# EAGLE design LinkSprite_Camera_Schematic2 (EAGLE 9.5.1)
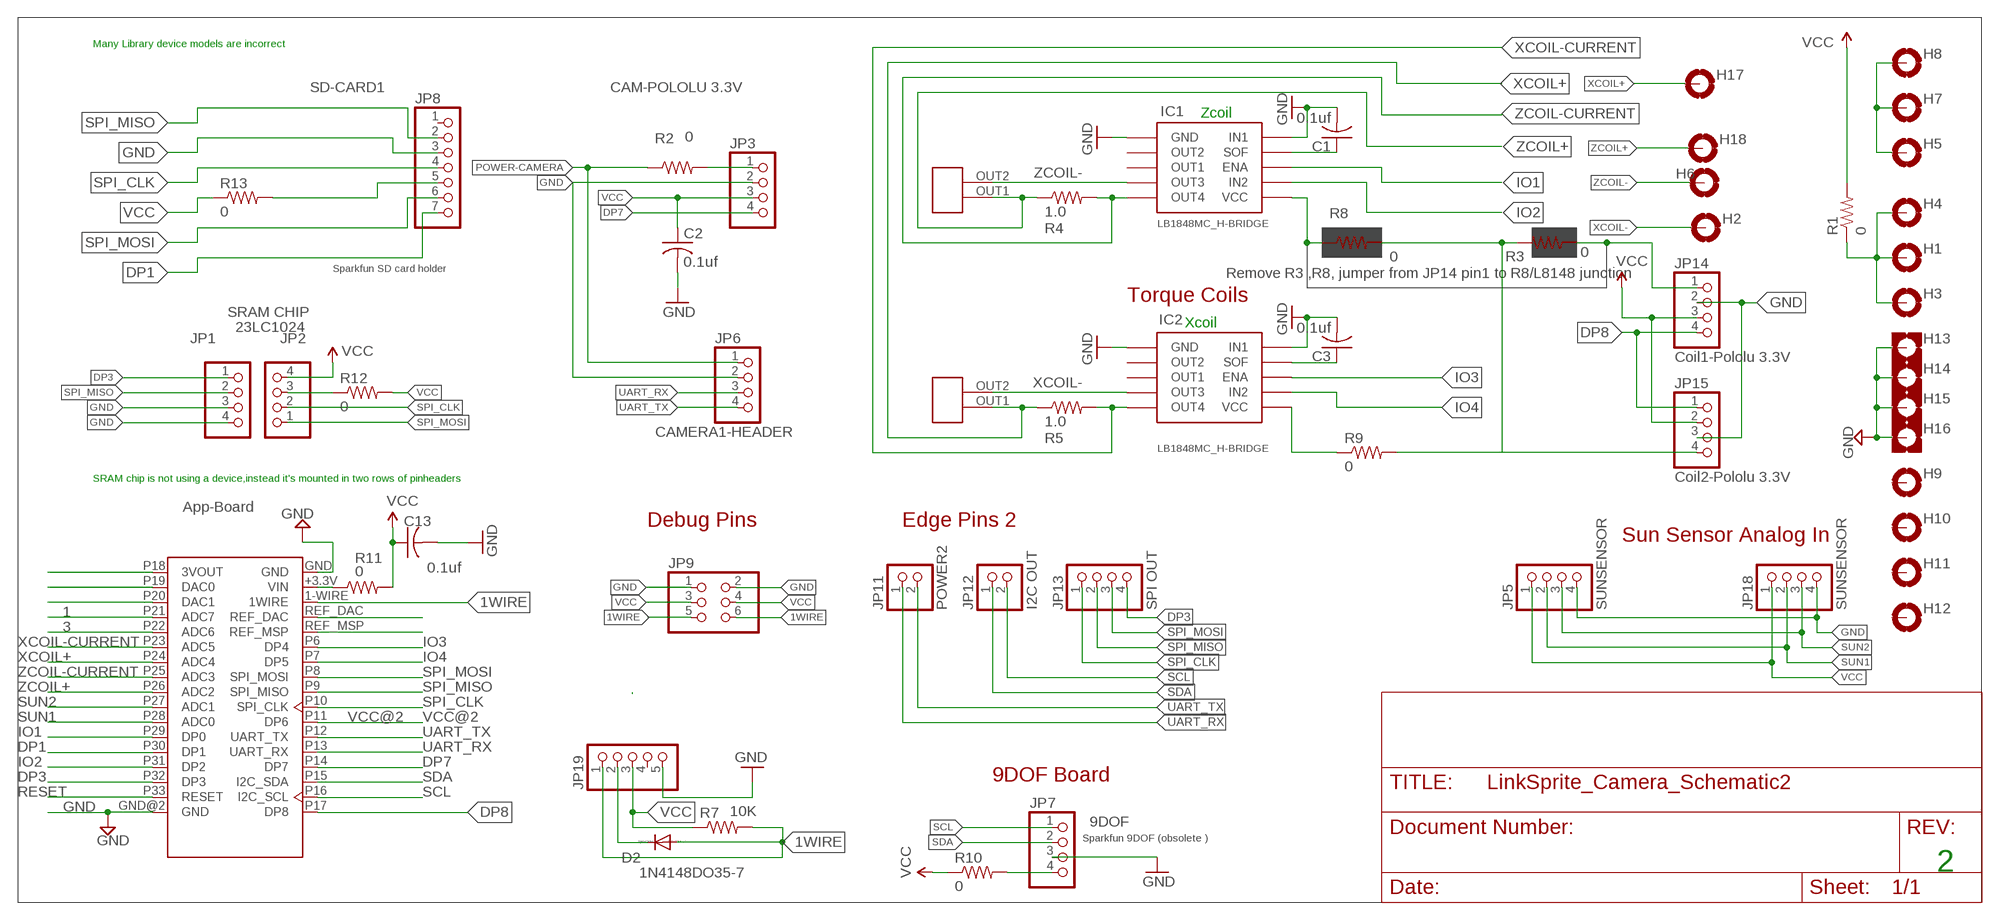
[diagram p0: schematic, sheet 1]

## Parts
C1  0.1uf  C-USC1206  [C1206]
C2  0.1uf  C-USC0805  [C0805]
C3  0.1uf  C-USC1206  [C1206]
C13  0.1uf  C-USC0805  [C0805]
D2  1N4148DO35-7  [DO35-7]
H1  MOUNT-PAD-ROUND3.3  [3,3-PAD]
H2  MOUNT-PAD-ROUND3.3  [3,3-PAD]
H3  MOUNT-PAD-ROUND3.3  [3,3-PAD]
H4  MOUNT-PAD-ROUND3.3  [3,3-PAD]
H5  MOUNT-PAD-ROUND3.3  [3,3-PAD]
H6  MOUNT-PAD-ROUND3.3  [3,3-PAD]
H7  MOUNT-PAD-ROUND3.3  [3,3-PAD]
H8  MOUNT-PAD-ROUND3.3  [3,3-PAD]
H9  MOUNT-PAD-ROUND3.3  [3,3-PAD]
H10  MOUNT-PAD-ROUND3.3  [3,3-PAD]
H11  MOUNT-PAD-ROUND3.3  [3,3-PAD]
H12  MOUNT-PAD-ROUND3.3  [3,3-PAD]
H13  MOUNT-PAD-SQUARE3.3  [3,3-PAD-SQUARE]
H14  MOUNT-PAD-SQUARE3.3  [3,3-PAD-SQUARE]
H15  MOUNT-PAD-SQUARE3.3  [3,3-PAD-SQUARE]
H16  MOUNT-PAD-SQUARE3.3  [3,3-PAD-SQUARE]
H17  MOUNT-PAD-ROUND3.3  [3,3-PAD]
H18  MOUNT-PAD-ROUND3.3  [3,3-PAD]
IC1  LB1848MC_H-BRIDGE  [LB1848MC_H-BRIDGE]
IC2  LB1848MC_H-BRIDGE  [LB1848MC_H-BRIDGE]
JP1  SRAMLEFT  PINHD-1X4  [1X04]
JP2  23LC1024  PINHD-1X4  [1X04]
JP3  CAM-POLOLU 3.3V  PINHD-1X4  [1X04]
JP5  SUNSENSOR  PINHD-1X4  [1X04]
JP6  CAMERA1-HEADER  PINHD-1X4  [1X04]
JP7  9DOF  PINHD-1X4  [1X04]
JP8  SD-CARD1  PINHD-1X7  [1X07]
JP9  PINHD-2X3  [2X03]
JP11  POWER2  PINHD-1X2  [1X02]
JP12  I2C OUT  PINHD-1X2  [1X02]
JP13  SPI OUT  PINHD-1X4  [1X04]
JP14  Coil1-Pololu 3.3V  PINHD-1X4  [1X04]
JP15  Coil2-Pololu 3.3V  PINHD-1X4  [1X04]
JP18  SUNSENSOR  PINHD-1X4  [1X04]
JP19  PINHD-1X5  [1X05]
R1  0  R-US_R0805  [R0805]
R2  0  R-US_R0805  [R0805]
R3  0  R-US_R0805  [R0805]
R4  1.0  R-US_R1206  [R1206]
R5  1.0  R-US_R1206  [R1206]
R7  10K  R-US_0204/7  [0204/7]
R8  0  R-US_R0805  [R0805]
R9  0  R-US_R0805  [R0805]
R10  0  R-US_R0805  [R0805]
R11  0  R-US_R0805  [R0805]
R12  0  R-US_R0805  [R0805]
R13  0  R-US_R0805  [R0805]
U$1  App-Board 1.2/1.3  APP_CORE  [APPCORE_RECEIVER]
U$5  COIL_PINOUT  [COIL_PINOUT]
U$6  COIL_PINOUT  [COIL_PINOUT]

## Nets
1: U$1.P21(ADC7)
1WIRE: D2.A H5.B3,3(MOUNT) H7.B3,3(MOUNT) H8.B3,3(MOUNT) JP9.5 JP9.6 JP19.1 R7.2 U$1.1-WIRE(1WIRE)
3: U$1.P22(ADC6)
COIL-POWER: JP15.4 R3.2 R8.2 R9.2
DP1: JP8.7 U$1.P30(DP1)
DP3: JP1.1 JP13.4 U$1.P32(DP3)
DP7: JP3.4 U$1.P14(DP7)
DP8: JP14.4 JP15.1 U$1.P17(DP8)
GND: C1.2 C2.2 C3.2 C13.2 H13.B3,3(MOUNT) H14.B3,3(MOUNT) H15.B3,3(MOUNT) H16.B3,3(MOUNT) IC1.GND IC1.IN1 IC2.GND IC2.IN1 JP1.3 JP1.4 JP3.2 JP5.4 JP6.2 JP7.3 JP8.3 JP9.1 JP9.2 JP14.2 JP15.3 JP18.4 JP19.5 U$1.GND U$1.GND@2(GND)
IO1: IC1.ENA U$1.P29(DP0)
IO2: IC1.IN2 U$1.P31(DP2)
IO3: IC2.ENA U$1.P6(DP4)
IO4: IC2.IN2 U$1.P7(DP5)
N$1: JP14.1 R3.1
N$2: H1.B3,3(MOUNT) H3.B3,3(MOUNT) H4.B3,3(MOUNT) R1.1
N$6: JP3.1 R2.2
N$7: IC1.VCC R8.1
N$9: IC2.VCC R9.1
N$10: JP7.4 R10.2
N$11: D2.C JP19.2
N$12: R11.1 U$1.+3.3V(VIN)
N$13: C3.1 IC2.SOF
N$14: C1.1 IC1.SOF
N$15: JP2.3 R12.1
N$16: JP8.5 R13.2
N$22: U$1.REF_DAC
N$23: U$1.REF_MSP
N$34: U$1.P18(3VOUT)
N$35: U$1.P19(DAC0)
N$36: U$1.P20(DAC1)
POWER-CAMERA: JP6.1 R2.1
RESET: U$1.P33(RESET)
SCL: JP7.1 JP12.2 U$1.P16(I2C_SCL)
SDA: JP7.2 JP12.1 U$1.P15(I2C_SDA)
SPI_CLK: JP2.2 JP8.4 JP13.1 U$1.P10(SPI_CLK)
SPI_MISO: JP1.2 JP8.2 JP13.2 U$1.P9(SPI_MISO)
SPI_MOSI: JP2.1 JP8.6 JP13.3 U$1.P8(SPI_MOSI)
SUN1: JP5.2 JP18.2 U$1.P28(ADC0)
SUN2: JP5.3 JP18.3 U$1.P27(ADC1)
UART_RX: JP6.3 JP11.1 U$1.P13(UART_RX)
UART_TX: JP6.4 JP11.2 U$1.P12(UART_TX)
VCC: C2.1 C13.1 JP2.4 JP3.3 JP5.1 JP9.3 JP9.4 JP14.3 JP15.2 JP18.1 JP19.3 R1.2 R7.1 R10.1 R11.2 R12.2 R13.1
VCC@2: U$1.P11(DP6)
XCOIL+: H17.B3,3(MOUNT) R5.1 U$1.P24(ADC4) U$6.OUT1
XCOIL-: H2.B3,3(MOUNT) IC2.OUT3 U$6.OUT2
XCOIL-CURRENT: IC2.OUT4 R5.2 U$1.P23(ADC5)
ZCOIL+: H18.B3,3(MOUNT) R4.1 U$1.P26(ADC2) U$5.OUT1
ZCOIL-: H6.B3,3(MOUNT) IC1.OUT3 U$5.OUT2
ZCOIL-CURRENT: IC1.OUT4 R4.2 U$1.P25(ADC3)
Unconnected: H9.B3,3(MOUNT) H10.B3,3(MOUNT) H11.B3,3(MOUNT) H12.B3,3(MOUNT) IC1.OUT1 IC1.OUT2 IC2.OUT1 IC2.OUT2 JP8.1 JP19.4

## Notes on the sheet
- Many Library device models are incorrect
- Zcoil
- IC1
- LB1848MC_H-BRIDGE
- Sparkfun SD card holder
- Remove R3 ,R8, jumper from JP14 pin1 to R8/L8148 junction
- Torque Coils
- SRAM CHIP | Xcoil
- IC2
- LB1848MC_H-BRIDGE
- SRAM chip is not using a device,instead it's mounted in two rows of pinheaders
- App-Board
- Debug Pins | Edge Pins 2
- Sun Sensor Analog In
- 9DOF Board
- Sparkfun 9DOF (obsolete )
- 2

## Library data of the parts
C1 C3 = rcl:C-US: CAPACITOR, American symbol
C2 C13 = resistor:C-US: CAPACITOR, American symbol
D2 = diode:1N4148: DIODE high speed (Philips)
H1-H12 H17 H18 = holes:MOUNT-PAD-ROUND: MOUNTING PAD, round
H13-H16 = holes:MOUNT-PAD-SQUARE: MOUNTING PAD, square
IC1 IC2 = 9DoF_board:LB1848MC_H-BRIDGE; DIGI_KEY: LB1848MC-AHOSCT-ND
JP1 JP3 JP5 JP7 JP13-JP15 JP18 = pinhead:PINHD-1X4: PIN HEADER
JP2 = pinhead:PINHD-1X4: PIN HEADER; DIGI-KEY: 23LC1024-I/P-ND
JP6 = pinhead:PINHD-1X4: PIN HEADER; DIGIKEY: SAM10018-ND
JP8 = pinhead:PINHD-1X7: PIN HEADER
JP9 = pinhead:PINHD-2X3: PIN HEADER
JP11 JP12 = pinhead:PINHD-1X2: PIN HEADER
JP19 = pinhead:PINHD-1X5: PIN HEADER
R1 R3 R7 = rcl:R-US_: RESISTOR, American symbol
R2 = rcl:R-US_: RESISTOR, American symbol; DIGI-KEY: 311-0.0ARCT-ND
R4 R5 R8-R13 = resistor:R-US_: RESISTOR, American symbol
U$1 = LearningByMaking2:APP_CORE
U$5 U$6 = 9DoF_board:COIL_PINOUT

## Module CAMERA
Ports: 

### Library data of the parts

## Board
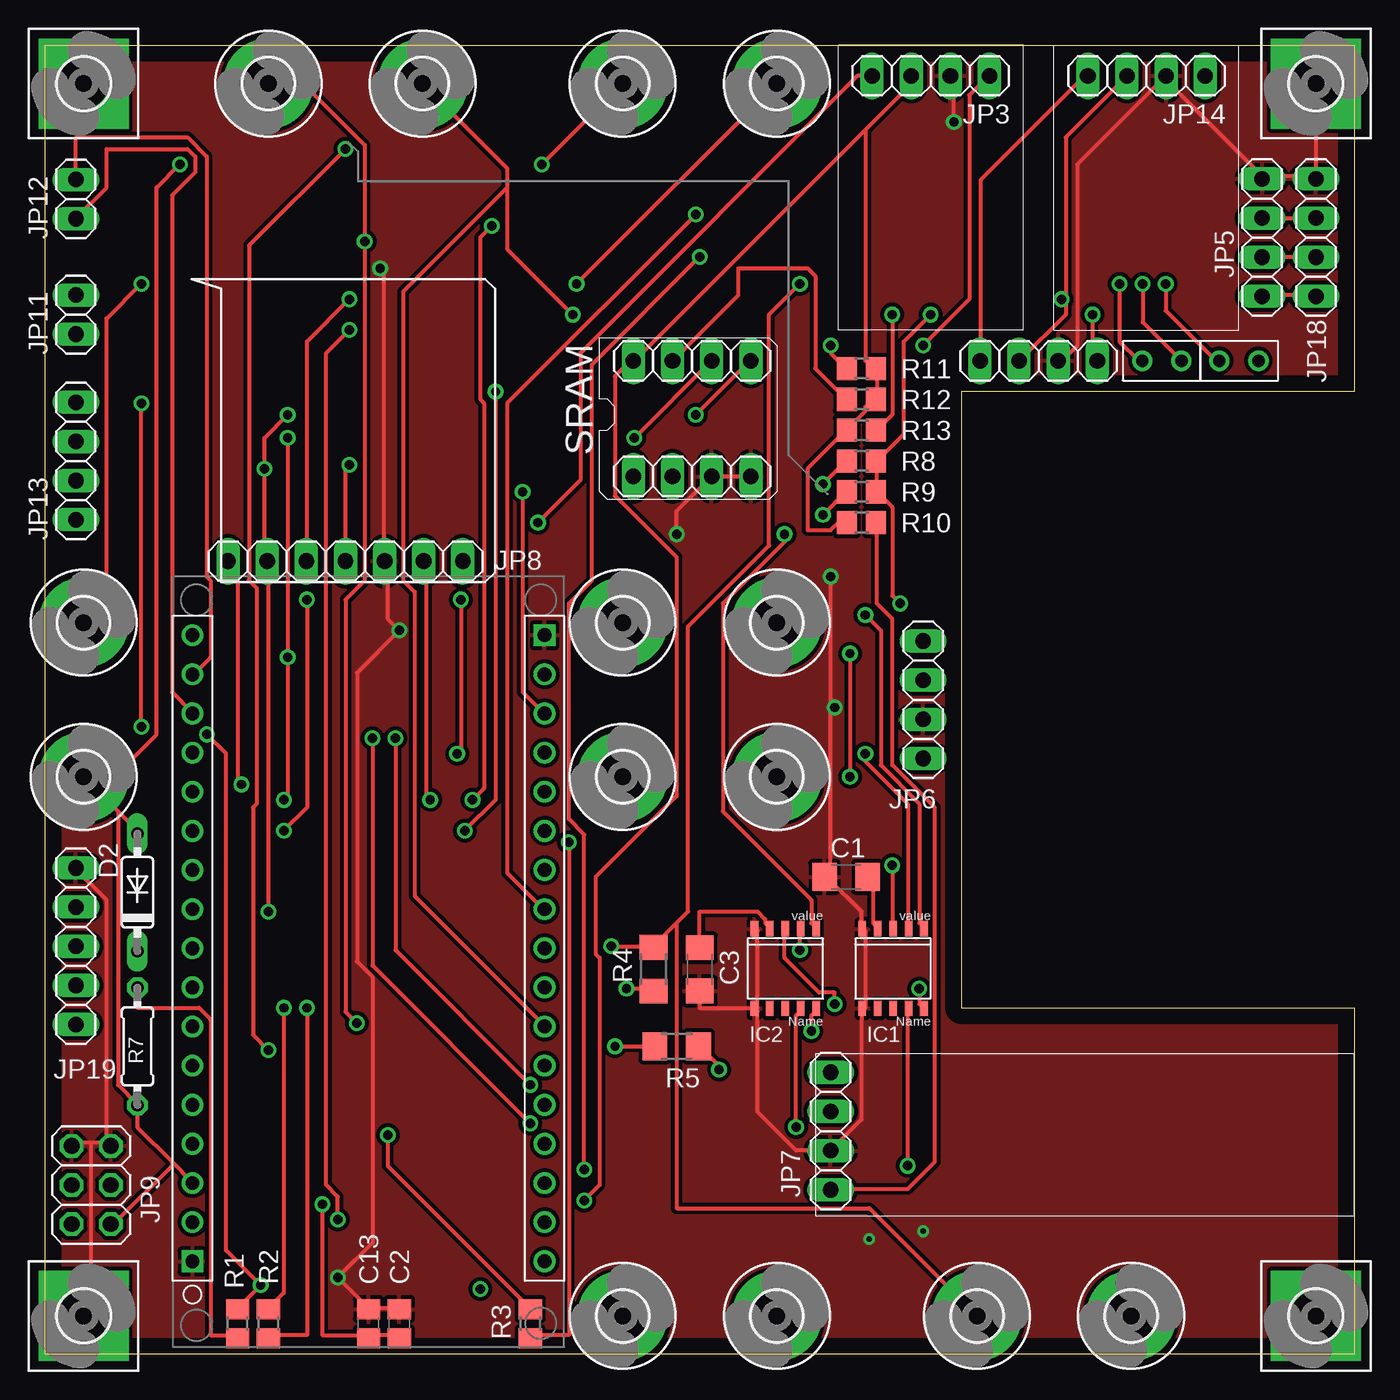
[diagram p1: board, top side]
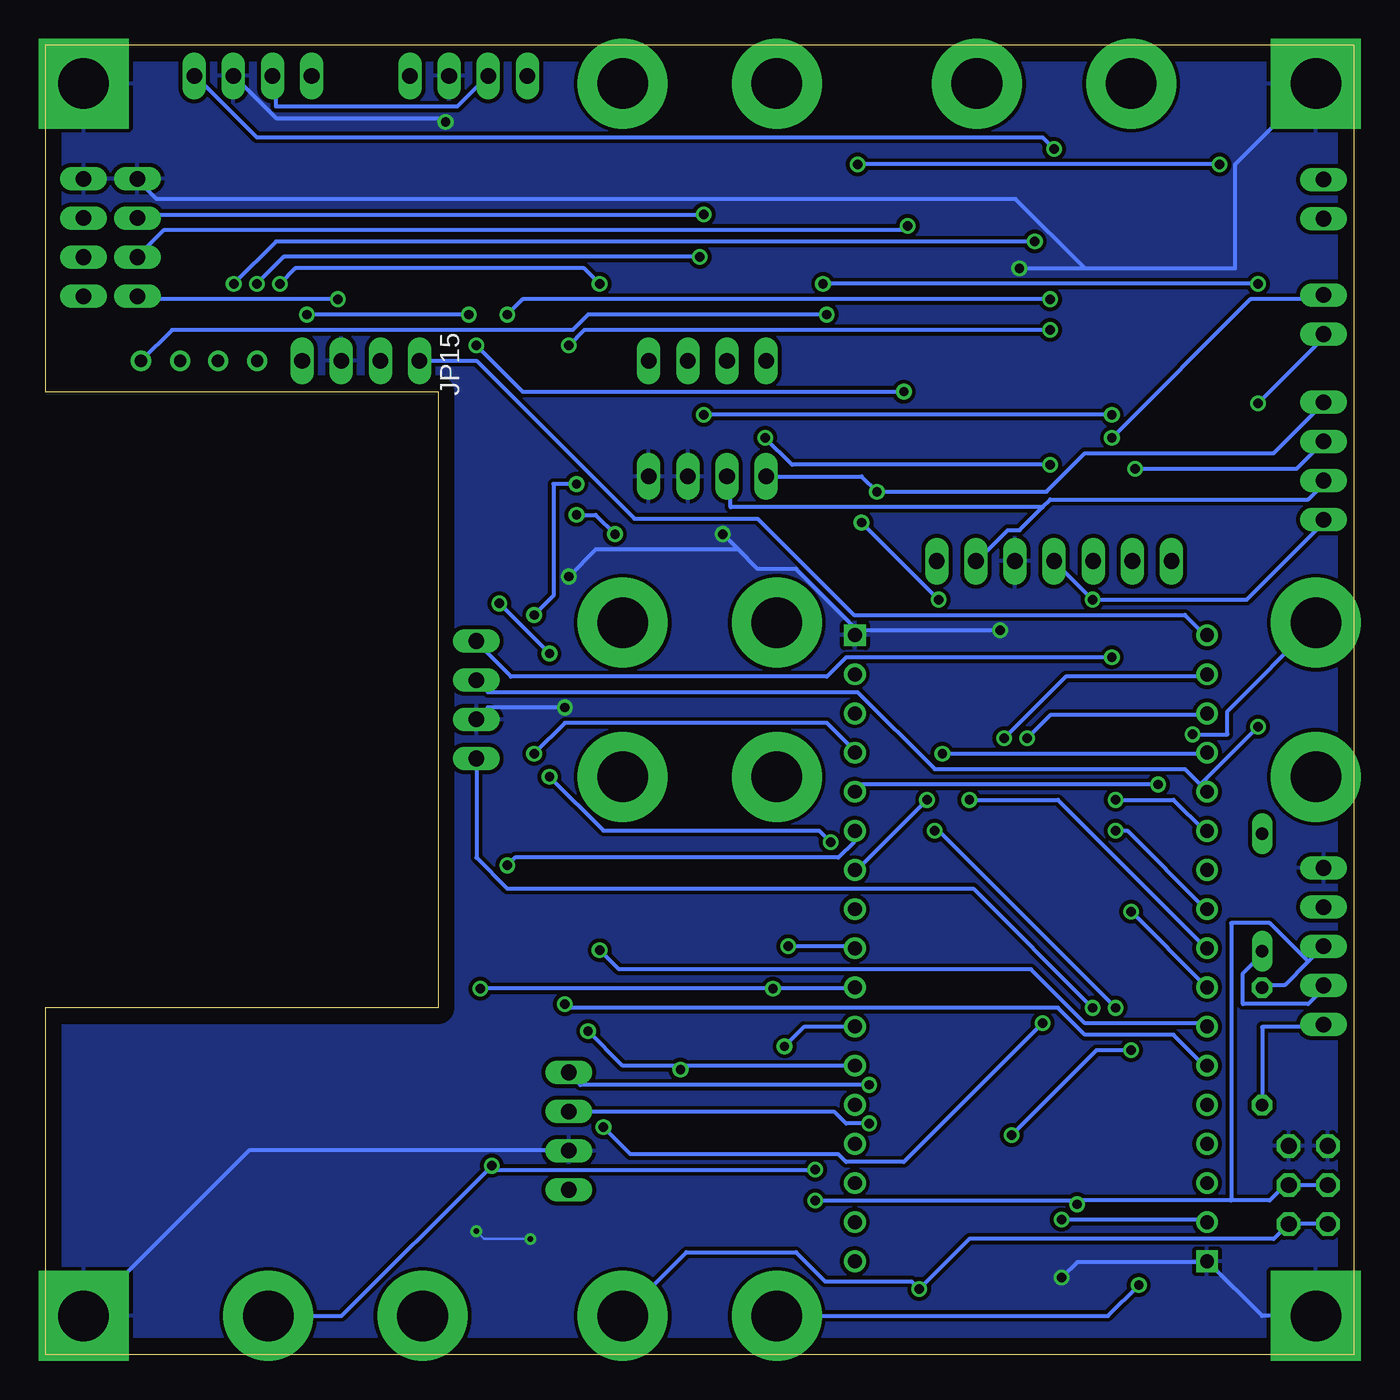
[diagram p2: board, bottom side, seen from below]

Size 85 x 85 mm. Coordinates in mm from the lower left corner, seen from the top.
Outline: 0,0 0,85 85,85 85,62.5 59.5,62.5 59.5,22.5 85,22.5 85,0 0,0
Copper layers (1*16): Top 0.035mm / dielectric 1.5mm / Bottom 0.035mm
Design rules "default *": minimum track width 10mil, minimum drill 24mil, track to track 10mil, track to pad 10mil, pad to pad 10mil, via to via 10mil, smd to smd 8mil, copper to edge 40mil, drill to drill 8mil, minimum pad ring 10mil, minimum via ring 8mil, stop-mask expansion 4mil, vias tented up to drill 0mil, thermal gap 10mil

### Footprints (pad centres in the part's own frame; a part is rotated, then mirrored left to right if it is on the bottom)
C1206 = smd 1.6 x 1.8: 1 -1.4,0; 2 1.4,0
C0805 = smd 1.3 x 1.5: 1 -0.95,0; 2 0.95,0
DO35-7 = drill 0.813 long: A 3.81,0; C -3.81,0
3,3-PAD = drill 3.3 pad 5.842: B3,3 0,0
3,3-PAD-SQUARE = drill 3.3 pad 5.842 square: B3,3 0,0
LB1848MC_H-BRIDGE = smd 0.492 x 1.002: ENA 2.45,-0.632; GND 4.45,4.533; IN1 4.45,-0.632; IN2 1.45,-0.632; OUT1 2.45,4.533; OUT2 3.45,4.533; OUT3 1.45,4.533; OUT4 0.45,4.533; SOF 3.45,-0.632; VCC 0.45,-0.632
1X04 = drill 1.016 long: 1 -3.81,0; 2 -1.27,0; 3 1.27,0; 4 3.81,0
1X07 = drill 1.016 long: 1 -7.62,0; 2 -5.08,0; 3 -2.54,0; 4 0,0; 5 2.54,0; 6 5.08,0; 7 7.62,0
2X03 = drill 1.016 octagon: 1 -2.54,-1.27; 2 -2.54,1.27; 3 0,-1.27; 4 0,1.27; 5 2.54,-1.27; 6 2.54,1.27
1X02 = drill 1.016 long: 1 -1.27,0; 2 1.27,0
1X05 = drill 1.016 long: 1 -5.08,0; 2 -2.54,0; 3 0,0; 4 2.54,0; 5 5.08,0
R0805 = smd 1.3 x 1.5: 1 -0.95,0; 2 0.95,0
R1206 = smd 1.6 x 1.803: 1 -1.422,0; 2 1.422,0
0204/7 = drill 0.813 octagon: 1 -3.81,0; 2 3.81,0
APPCORE_RECEIVER = drill 0.9: 1-WIRE 11.43,14.37; +3.3V 11.43,16.91; P6 11.43,6.75; P7 11.43,4.21; P8 11.43,1.67; P9 11.43,-0.87; P10 11.43,-3.41; P11 11.43,-5.95; P12 11.43,-8.49; P13 11.43,-11.03; P14 11.43,-13.57; P15 11.43,-16.11; P16 11.43,-18.65; P17 11.43,-21.19; P18 -11.43,19.45; P19 -11.43,16.91; P20 -11.43,14.37; P21 -11.43,11.83; P22 -11.43,9.29; P23 -11.43,6.75; P24 -11.43,4.21; P25 -11.43,1.67; P26 -11.43,-0.87; P27 -11.43,-3.41; P28 -11.43,-5.95; P29 -11.43,-8.49; P30 -11.43,-11.03; P31 -11.43,-13.57; P32 -11.43,-16.11; P33 -11.43,-18.65; REF_DAC 11.43,11.83; REF_MSP 11.43,9.29 | drill 0.9 square: GND 11.43,19.45; GND@2 -11.43,-21.19
COIL_PINOUT = drill 0.8: OUT1 0,1.27; OUT2 0,-1.27

### Placement (x,y rotation side)
C1  52,31 180 top
C2  23,2 90 top
C3  42.5,25 270 top
C13  21,2 90 top
D2  6,30 90 top
H1  37.5,2.5 0 top
H2  14.5,82.5 0 top
H3  47.5,82.5 0 top
H4  2.5,47.5 0 top
H5  47.5,2.5 0 top
H6  70.5,2.5 0 top
H7  2.5,37.5 0 top
H8  37.5,82.5 0 top
H9  47.5,47.5 0 top
H10  47.5,37.5 0 top
H11  37.5,47.5 0 top
H12  37.5,37.5 0 top
H13  82.5,82.5 0 top
H14  2.5,82.5 0 top
H15  82.5,2.5 0 top
H16  2.5,2.5 0 top
H17  24.5,82.5 0 top
H18  60.5,2.5 0 top
IC1  57.5,27 180 top
IC2  50.5,27 180 top
JP1  42,57 0 top
JP2  42,64.5 180 top
JP3  57.5,83 180 top
JP5  79,72.5 90 top
JP6  57,42.5 90 top
JP7  51,14.5 270 top
JP8  19.5,51.5 180 top
JP9  3,11 270 top
JP11  2,67.5 90 top
JP12  2,75 90 top
JP13  2,58 90 top
JP14  71.5,83 180 top
JP15  64.5,64.5 0 top
JP18  82.5,72.5 90 top
JP19  2,26.5 90 top
R1  12.5,2 270 top
R2  14.5,2 90 top
R3  31.5,2 270 top
R4  39.5,25 270 top
R5  41,20 0 top
R7  6,20 270 top
R8  53,58 0 top
R9  53,56 0 top
R10  53,54 0 top
R11  53,64 0 top
R12  53,62 0 top
R13  53,60 0 top
U$1  21,25.5 180 top
U$5  72.5,64.5 90 top
U$6  77.5,64.5 270 top

### Tracks (layer width: path | path; a pad name or v marks a point on that pad's centre or on a via)
1WIRE  (via drill 0.61)
  Top 0.254: 8.25,12.5 6,14.75 R7.2 6,16.25 4.75,17.5 4.75,35.25 | 8.25,12.5 9.5,11.25 U$1.1-WIRE | 8.25,12.5 8.25,12.25 4.5,8.5 JP9.6 | 3.5,36.5 4.75,35.25 | 4.75,35.25 6,34 D2.A | v32.25,77.25 H8.B3,3 | v8.75,77.25 7.25,75.75 7.25,40.25 3.5,36.5 | 3.5,36.5 H7.B3,3
  Bottom 0.254: H5.B3,3 43.37,6.63 36.25,6.63 34.37,4.75 28.75,4.75 v28.25,4.25 25,7.5 5.25,7.5 4.5,8.25 JP9.6 4.25,8.5 1.75,8.5 JP9.5 | R7.2 6,21.25 2,21.25 JP19.1 | v8.75,77.25 v32.25,77.25
COIL-POWER  (via drill 0.61)
  Top 0.254: v34,33.25 34,1.25 31.5,1.25 R3.2 | v52.25,45.5 v52.25,37.5 | v55.5,48.75 55,49.25 55,55 54,56 | 54,56 54,58 | 54,56 R9.2 | v68,67.5 68,64.75 68.25,64.5 JP15.4 | v57.5,67.5 55.75,65.75 55.75,59.75 54,58 | 54,58 R8.2
  Bottom 0.254: v34,33.25 34.75,34 48.75,34 v52.25,37.5 | v55.5,48.75 v52.25,45.5 | v57.5,67.5 v68,67.5
DP1  (via drill 0.61)
  Top 0.254: v12.75,37 12.5,37.25 12.5,51 12,51.5 JP8.7
  Bottom 0.254: v12.75,37 32,37 32.25,36.75 U$1.P30
DP3  (via drill 0.61)
  Top 0.254: v31,56 31,43 32.25,41.75 U$1.P32
  Bottom 0.254: JP1.1 32,57 v31,56 20,56 17.5,58.5 5.25,58.5 2,61.75 JP13.4
DP7  (via drill 0.61)
  Top 0.254: v26.75,39 27,39.25 v27,49 | v32,54 34.75,56.75 34.75,65 52.75,83 JP3.4
  Bottom 0.254: v26.75,39 9.75,39 U$1.P14 | v32,54 v27,49
DP8
  Top 0.254: JP14.4 67.5,83 60.75,76.25 60.75,64.5 JP15.1
  Bottom 0.254: JP15.1 57,64.5 46.75,54.25 38.75,54.25 32.5,48 11,48 9.75,46.75 U$1.P17
GND  (via drill 0.35, 0.61)
  Top 0.254: C3.2 42.5,22.5 46,22.5 IC2.GND | IC2.IN1 46.25,27.5 46.25,22.5 IC2.GND | 51,30.75 53,28.75 53,27.75 IC1.IN1 53.25,27.5 53.25,22.5 IC1.GND 53,22.25 53,15.25 51,13.25 | 51,30.75 50.75,31 C1.2 51,30.75 | 51,30.75 51,41.75 v51.25,42 51,42.25 v51,50.5 | 51,13.25 48.75,13.25 46.25,15.75 46.25,22.25 IC2.GND | 51,13.25 JP7.3 | 4,13.75 4.25,13.75 JP9.2 4,13.75 | 4,13.75 3,13.75 | 3,13.75 1.75,13.75 JP9.1 | 4,13.75 4,29.5 2,31.5 JP19.5 | 21,3 23,3 C2.2 | 21,3 v19,5 21.25,7.25 21.25,24.5 20.25,25.5 20.25,44.25 v23,47 22.25,47.75 22.25,51.5 JP8.3 22,51.5 22,70.25 v21.75,70.5 | 21,3 C13.2 | 3,13.75 3,3 H16.B3,3 | 82.5,76.5 79,76.5 | H13.B3,3 82.5,76.5 | 82.5,76.5 JP18.4 | JP15.3 66,64.5 67,65.5 67,77.25 72.75,83 JP14.2 73,83 73,82.5 79,76.5 | v59,80 59,83 JP3.2 | 79,76.5 JP5.4 | JP1.4 JP1.3 43.25,57 41,54.75 v41,53.25
  Bottom 0.152: v53.5,7.5 56.5,7.5 v57,8
  Bottom 0.254: v51.25,42 56.25,42 57,41.25 JP6.2 | H15.B3,3 71.75,13.25 51,13.25 JP7.3 | v19,5 18,6 9.75,6 U$1.GND 9.5,6 6,2.5 H16.B3,3 | v59,80 59.25,80.25 70,80.25 72.75,83 JP14.2 | 32,47 32.25,46.75 U$1.GND@2 32,47 | v23,47 32,47 | 40,52.25 38.75,51 36.25,51 32.25,47 32,47 | 40,52.25 v41,53.25 | H14.B3,3 7.75,77.25 7.75,70.5 17.5,70.5 | v21.75,70.5 17.5,70.5 | 17.5,70.5 22,75 77.75,75 79,76.25 JP5.4 | v51,50.5 49.25,52.25 40,52.25
  pour Top: 0,85 85,85 85,62.5 59.5,62.5 59.5,22.5 85,22.5 85,0 0,0
  pour Bottom: 0,85 85,85 85,62.5 59.5,62.5 59.5,22.5 85,22.5 85,0 0,0
IO1  (via drill 0.61)
  Top 0.254: v55,31.75 55,27.75 IC1.ENA
  Bottom 0.254: v55,31.75 54.5,32.25 33.5,32.25 32.5,33.25 32.5,33.75 U$1.P29
IO2  (via drill 0.61)
  Top 0.254: v53.25,39 53.25,38.5 56,35.75 56,27.75 IC1.IN2
  Bottom 0.254: v53.25,39 51.25,41 34.25,41 32.5,39.25 U$1.P31
IO3  (via drill 0.61)
  Top 0.254: v51.25,22.75 51.25,23.5 50.25,23.5 48,25.75 48,27.5 IC2.ENA
  Bottom 0.254: v51.25,22.75 51,22.5 19.25,22.5 17.5,20.75 11.75,20.75 9.75,18.75 U$1.P6
IO4  (via drill 0.61)
  Top 0.254: v49,26.25 49,27.5 IC2.IN2
  Bottom 0.254: v49,26.25 47.75,25 21,25 17.5,21.5 9.75,21.5 U$1.P7
N$1  (via drill 0.61)
  Top 0.254: v22.25,14.25 22.25,12.25 31.5,3 R3.1 | v14.5,19.75 13.5,20.75 13.5,35.5 13.75,35.75 13.75,49.75 13.25,50.25 13.25,72 v19.5,78.25
  Bottom 0.254: v22.25,14.25 16.75,19.75 v14.5,19.75 | v19.5,78.25 20.25,79 71.25,79 75.25,83 JP14.1
N$2  (via drill 0.61)
  Top 0.254: R1.1 12.5,3 v14,4.5 11.75,6.75 11.75,39 v10.5,40.25 | v34.5,69.5 H3.B3,3 | v6.25,69.5 4,67.25 4,49 H4.B3,3
  Bottom 0.254: v14,4.5 16,2.5 H1.B3,3 | H4.B3,3 8.25,41.75 8.25,40.25 v10.5,40.25 | v6.25,69.5 v34.5,69.5
N$6  (via drill 0.61)
  Top 0.254: v15.5,22.5 15.5,4 14.5,3 R2.2 | v27.25,34 29.25,36 v29.25,62.5 | v57,65.5 60,68.5 60,81.75 61.25,83 JP3.1
  Bottom 0.254: v15.5,22.5 27,34 v27.25,34 | v29.25,62.5 54,62.5 v57,65.5
N$7  (via drill 0.61)
  Top 0.254: v53.25,48 54.25,47 54.25,38.25 56.75,35.75 56.75,28 57,27.75 IC1.VCC | v50.5,56.5 52,58 R8.1
  Bottom 0.254: v53.25,48 52,49.25 52,56.5 v50.5,56.5
N$9  (via drill 0.61)
  Top 0.254: v48,53.25 48,52.75 44,48.75 44,35.25 49.75,29.5 49.75,28 50,27.75 IC2.VCC | v50.5,54.5 52,56 R9.1
  Bottom 0.254: v48,53.25 49.25,54.5 v50.5,54.5
N$10
  Top 0.254: R10.2 54,54 54,48.75 55,47.75 55,38.25 57.75,35.5 57.75,12.5 56,10.75 51,10.75 JP7.4
N$11
  Bottom 0.254: D2.C 6,26 7.25,24.75 7.25,22.75 3,22.75 2,23.75 JP19.2
N$12  (via drill 0.61)
  Top 0.254: v51,65.5 51,65 52,64 R11.1 | v19.75,66.5 18.25,65 18.25,11 19,10.25 v19,8.75
  Bottom 0.254: v51,65.5 50,66.5 v19.75,66.5 | v19,8.75 9.75,8.75 U$1.+3.3V
N$13
  Top 0.254: C3.1 42.5,28.75 46.25,28.75 46.75,28.25 46.75,28 47,27.75 IC2.SOF
N$14
  Top 0.254: IC1.SOF 54,27.75 53.75,28 53.75,30.75 53.5,31 C1.1
N$15
  Top 0.254: R12.1 52,62 50,64 50,70 49.5,70.5 45,70.5 45,68.75 40.75,64.5 JP2.3
N$16  (via drill 0.61)
  Top 0.254: v55,67.5 55,61 54,60 R13.2 | v19.75,68.5 17,65.75 17,51.5 JP8.5
  Bottom 0.254: v55,67.5 54,68.5 v19.75,68.5
POWER-CAMERA  (via drill 0.61)
  Top 0.254: v17,22.5 17,1.25 14.5,1.25 R2.1
  Bottom 0.254: v17,22.5 24.75,30.25 55,30.25 57,32.25 JP6.1
SCL  (via drill 0.61)
  Top 0.254: JP12.2 2,79 9.25,79 10.5,77.75 10.5,50.5 10.75,50.25 10.75,45.25 9.75,44.25 U$1.P16 | v31.5,17.5 22.75,26.25 v22.75,40
  Bottom 0.254: v31.5,17.5 50.25,17.5 51,18.25 JP7.1 | v22.75,40 18.75,44 9.75,44 U$1.P16
SDA  (via drill 0.61)
  Top 0.254: U$1.P15 9.5,41.75 8.25,43 8.25,75.25 9.75,76.75 9.75,77.75 9.25,78.25 4,78.25 4,75.75 2,73.75 JP12.1 | v31.5,15 21.25,25.25 v21.25,40
  Bottom 0.254: v31.5,15 33,15 33.75,15.75 51,15.75 JP7.2 | v21.25,40 19.75,41.5 9.75,41.5 U$1.P15
SPI_CLK  (via drill 0.61)
  Top 0.254: v15.5,34 17,35.5 v17,49 | v38.25,59.5 43.25,64.5 JP2.2 | v19.75,57.75 19.5,57.5 JP8.4
  Bottom 0.254: v15.5,34 14.75,34 9.75,29 U$1.P10 | JP8.4 v17,49 7,49 2,54 JP13.1 | v38.25,59.5 36.5,57.75 v19.75,57.75
SPI_MISO  (via drill 0.61)
  Top 0.254: v25,36 24.75,36.25 24.75,51.5 JP8.2
  Bottom 0.254: v25,36 19.25,36 9.75,26.5 U$1.P9 | 20.25,55 21.75,53.5 22.5,53.5 24.5,51.5 JP8.2 | 20.25,55 19.75,55.5 3,55.5 2,56.5 JP13.2 | 20.25,55 40.5,55 40.5,57 JP1.2
SPI_MOSI  (via drill 0.61)
  Top 0.254: v14.5,28.75 14.5,51.5 JP8.6 14.25,51.5 v14.25,57.5 14.25,59.5 v15.75,61 | v42.25,61 45.75,64.5 JP2.1
  Bottom 0.254: v14.5,28.75 9.75,24 U$1.P8 | v14.25,57.5 3.75,57.5 2,59.25 JP13.3 | v15.75,61 v42.25,61
SUN1  (via drill 0.61)
  Top 0.254: v27.75,36 28.5,36.75 28.5,61.75 28.25,62 28.25,72.5 v29,73.25 | JP18.2 82.5,71.25 79,71.25 JP5.2
  Bottom 0.254: v27.75,36 32.25,31.5 U$1.P28 | v29,73.25 29.25,73 77.25,73 79,71.25 JP5.2
SUN2  (via drill 0.61)
  Top 0.254: v42.25,74 30,61.75 30,31.25 32.25,29 U$1.P27 | JP18.3 82.5,73.75 79,73.75 JP5.3
  Bottom 0.254: v42.25,74 79,74 JP5.3
UART_RX  (via drill 0.61)
  Top 0.254: v6.25,40.75 v6.25,61.75
  Bottom 0.254: 10,37 11,38 27.25,38 32.25,43 56.25,43 57,43.75 JP6.3 | 10,37 9.75,36.75 U$1.P13 10,37 | v6.25,61.75 2,66 JP11.1 | 10,37 v6.25,40.75
UART_TX  (via drill 0.61)
  Top 0.254: v15.5,36 15.75,36.25 v15.75,45.25 v15.75,59.5
  Bottom 0.254: v15.5,36 11.75,36 9.75,34 U$1.P12 | v15.75,59.5 6.75,68.5 2.25,68.5 2,68.75 JP11.2 | v15.75,45.25 33,45.25 34.25,44 54.75,44 57,46.25 JP6.4
VCC  (via drill 0.61)
  Top 0.254: 21,1.25 23,1.25 C2.1 | 21,1.25 18,1.25 v18,9.75 | 21,1.25 C13.1 | R7.1 6,22.5 10,22.5 10.75,21.75 10.75,1.25 12.5,1.25 R1.2 | JP5.1 79,68.75 82.5,68.75 JP18.1 | 66.25,68.5 66.25,79 70,82.75 70,83 JP14.3 | 66.25,68.5 66.25,67.5 63.25,64.5 JP15.2 | 66.25,68.5 v66,68.5 | R10.1 51.5,54 51,53.5 49.5,53.5 49.5,57.5 52,60 R13.1 52.25,60 52.25,60.25 53.25,61.25 53.25,61.5 53.75,62 R12.2 54,62 54,64 R11.2 53.75,64 53.25,64.5 53.25,79.5 | 53.25,79.5 56,82.25 56,83 JP3.3 | 53.25,79.5 38.25,64.5 JP2.4 38,64.5 37,63.5 37,55.75 41,51.75 41,36.25 35.75,31 35.75,26 36,25.75 36,11 v35,10
  Bottom 0.254: 8,10 5.5,10 4.5,11 JP9.4 JP9.3 | 8,10 17.75,10 v18,9.75 18.25,10 v35,10 | 3,25.5 4.5,24 6,24 R7.1 | 3,25.5 JP19.3 | 8,10 8,28 5.5,28 3,25.5 | v66,68.5 79,68.5 JP5.1 | JP14.3 70,83 70,81 58.25,81 56.25,83 JP3.3
XCOIL+  (via drill 0.61)
  Top 0.254: v37,20 R5.1 | v34.25,67.5 30,71.75 30,75.75 | 30,75.75 30,77 H17.B3,3 | 30,75.75 23.25,69 23.25,50.25 24,49.5 24,29.75 32.25,21.5 U$1.P24
  Bottom 0.254: v37,20 35.75,21.25 32.5,21.25 U$1.P24 | v34.25,67.5 49.75,67.5 50.75,66.5 76.75,66.5 78.75,64.5 U$6.OUT1
XCOIL-  (via drill 0.61)
  Top 0.254: v48.75,14.75 48.75,22 49,22.25 IC2.OUT3 | v20.25,21.5 19.5,22.25 19.5,49 20.75,50.25 v20.75,72.25 20.75,78.5 16.75,82.5 H2.B3,3 | v72.75,69.5 72.75,67.75 76,64.5 U$6.OUT2
  Bottom 0.254: v48.75,14.75 47,13 33.5,13 33,12.5 29.25,12.5 v20.25,21.5 | v72.75,69.5 70,72.25 v20.75,72.25
XCOIL-CURRENT  (via drill 0.61)
  Top 0.254: v49.75,21 49.75,22 50,22.25 IC2.OUT4 | v43.75,18.5 43.75,18.75 42.5,20 R5.2
  Bottom 0.254: v49.75,21 47.5,18.75 43.75,18.75 | U$1.P23 43.75,18.75 | 43.75,18.75 v43.75,18.5
ZCOIL+  (via drill 0.61)
  Top 0.254: v36.75,26.5 39.5,26.5 | v69.75,69.5 69.75,65.75 71,64.5 U$5.OUT1 | v49,69.5 47,67.5 47,52.5 41.75,47.25 41.75,28.75 41,28 | 39.5,26.5 41,28 | 39.5,26.5 R4.1 | H18.B3,3 53.5,9.5 41,9.5 41,28
  Bottom 0.254: v36.75,26.5 32.5,26.5 U$1.P26 | v69.75,69.5 68.75,70.5 50,70.5 v49,69.5
ZCOIL-  (via drill 0.61)
  Top 0.254: v56,12.25 56,22.25 IC1.OUT3 | v71.25,69.5 71.25,67 73.75,64.5 U$5.OUT2 | v42.5,71.25 35.5,64.25 35.5,50.25 34,48.75 34,34.75 35,33.75 v35,12
  Bottom 0.254: 56.25,12 65.75,2.5 H6.B3,3 | v71.25,69.5 69.5,71.25 v42.5,71.25 | 56.25,12 v35,12 | 56.25,12 v56,12.25
ZCOIL-CURRENT  (via drill 0.61)
  Top 0.254: v56.75,23.75 56.75,22.75 57,22.5 IC1.OUT4 | v37.75,23.75 39.5,23.75 R4.2
  Bottom 0.254: v56.75,23.75 v37.75,23.75 32.5,23.75 U$1.P25

### Text on the board
tPlace: SRAM
tNames: IC2 | IC1